# EAGLE schematic RFboardLeiden48_V_1.00 (EAGLE 7.7.0)
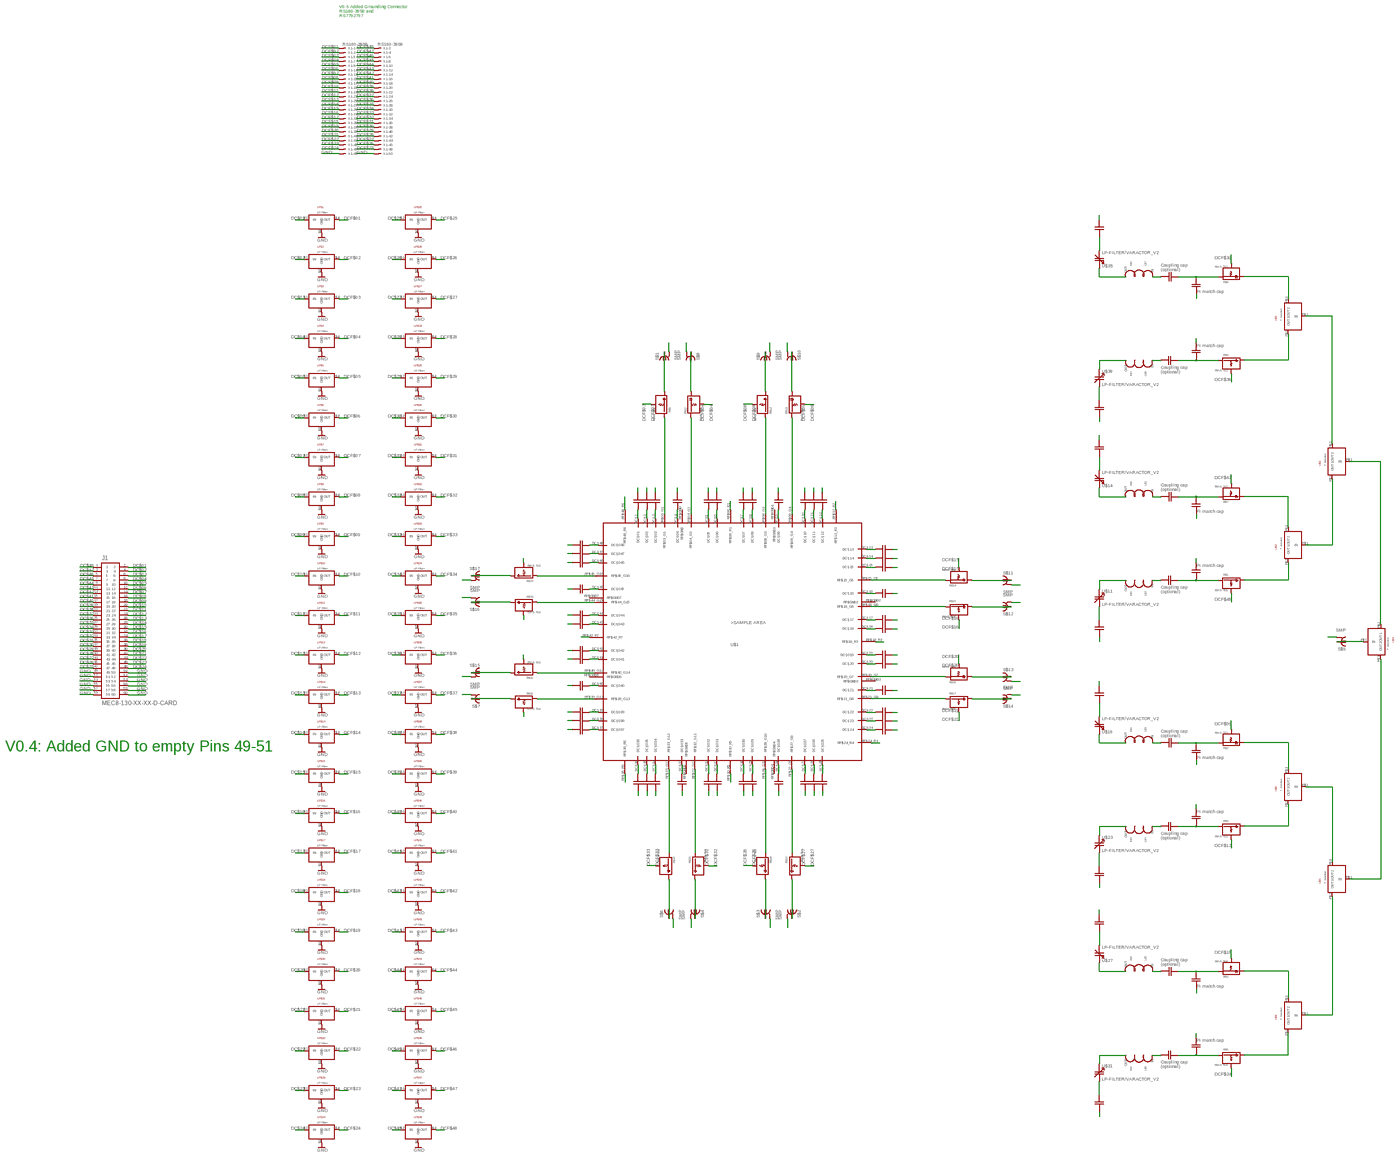
[diagram p0: schematic, sheet 1, overview]
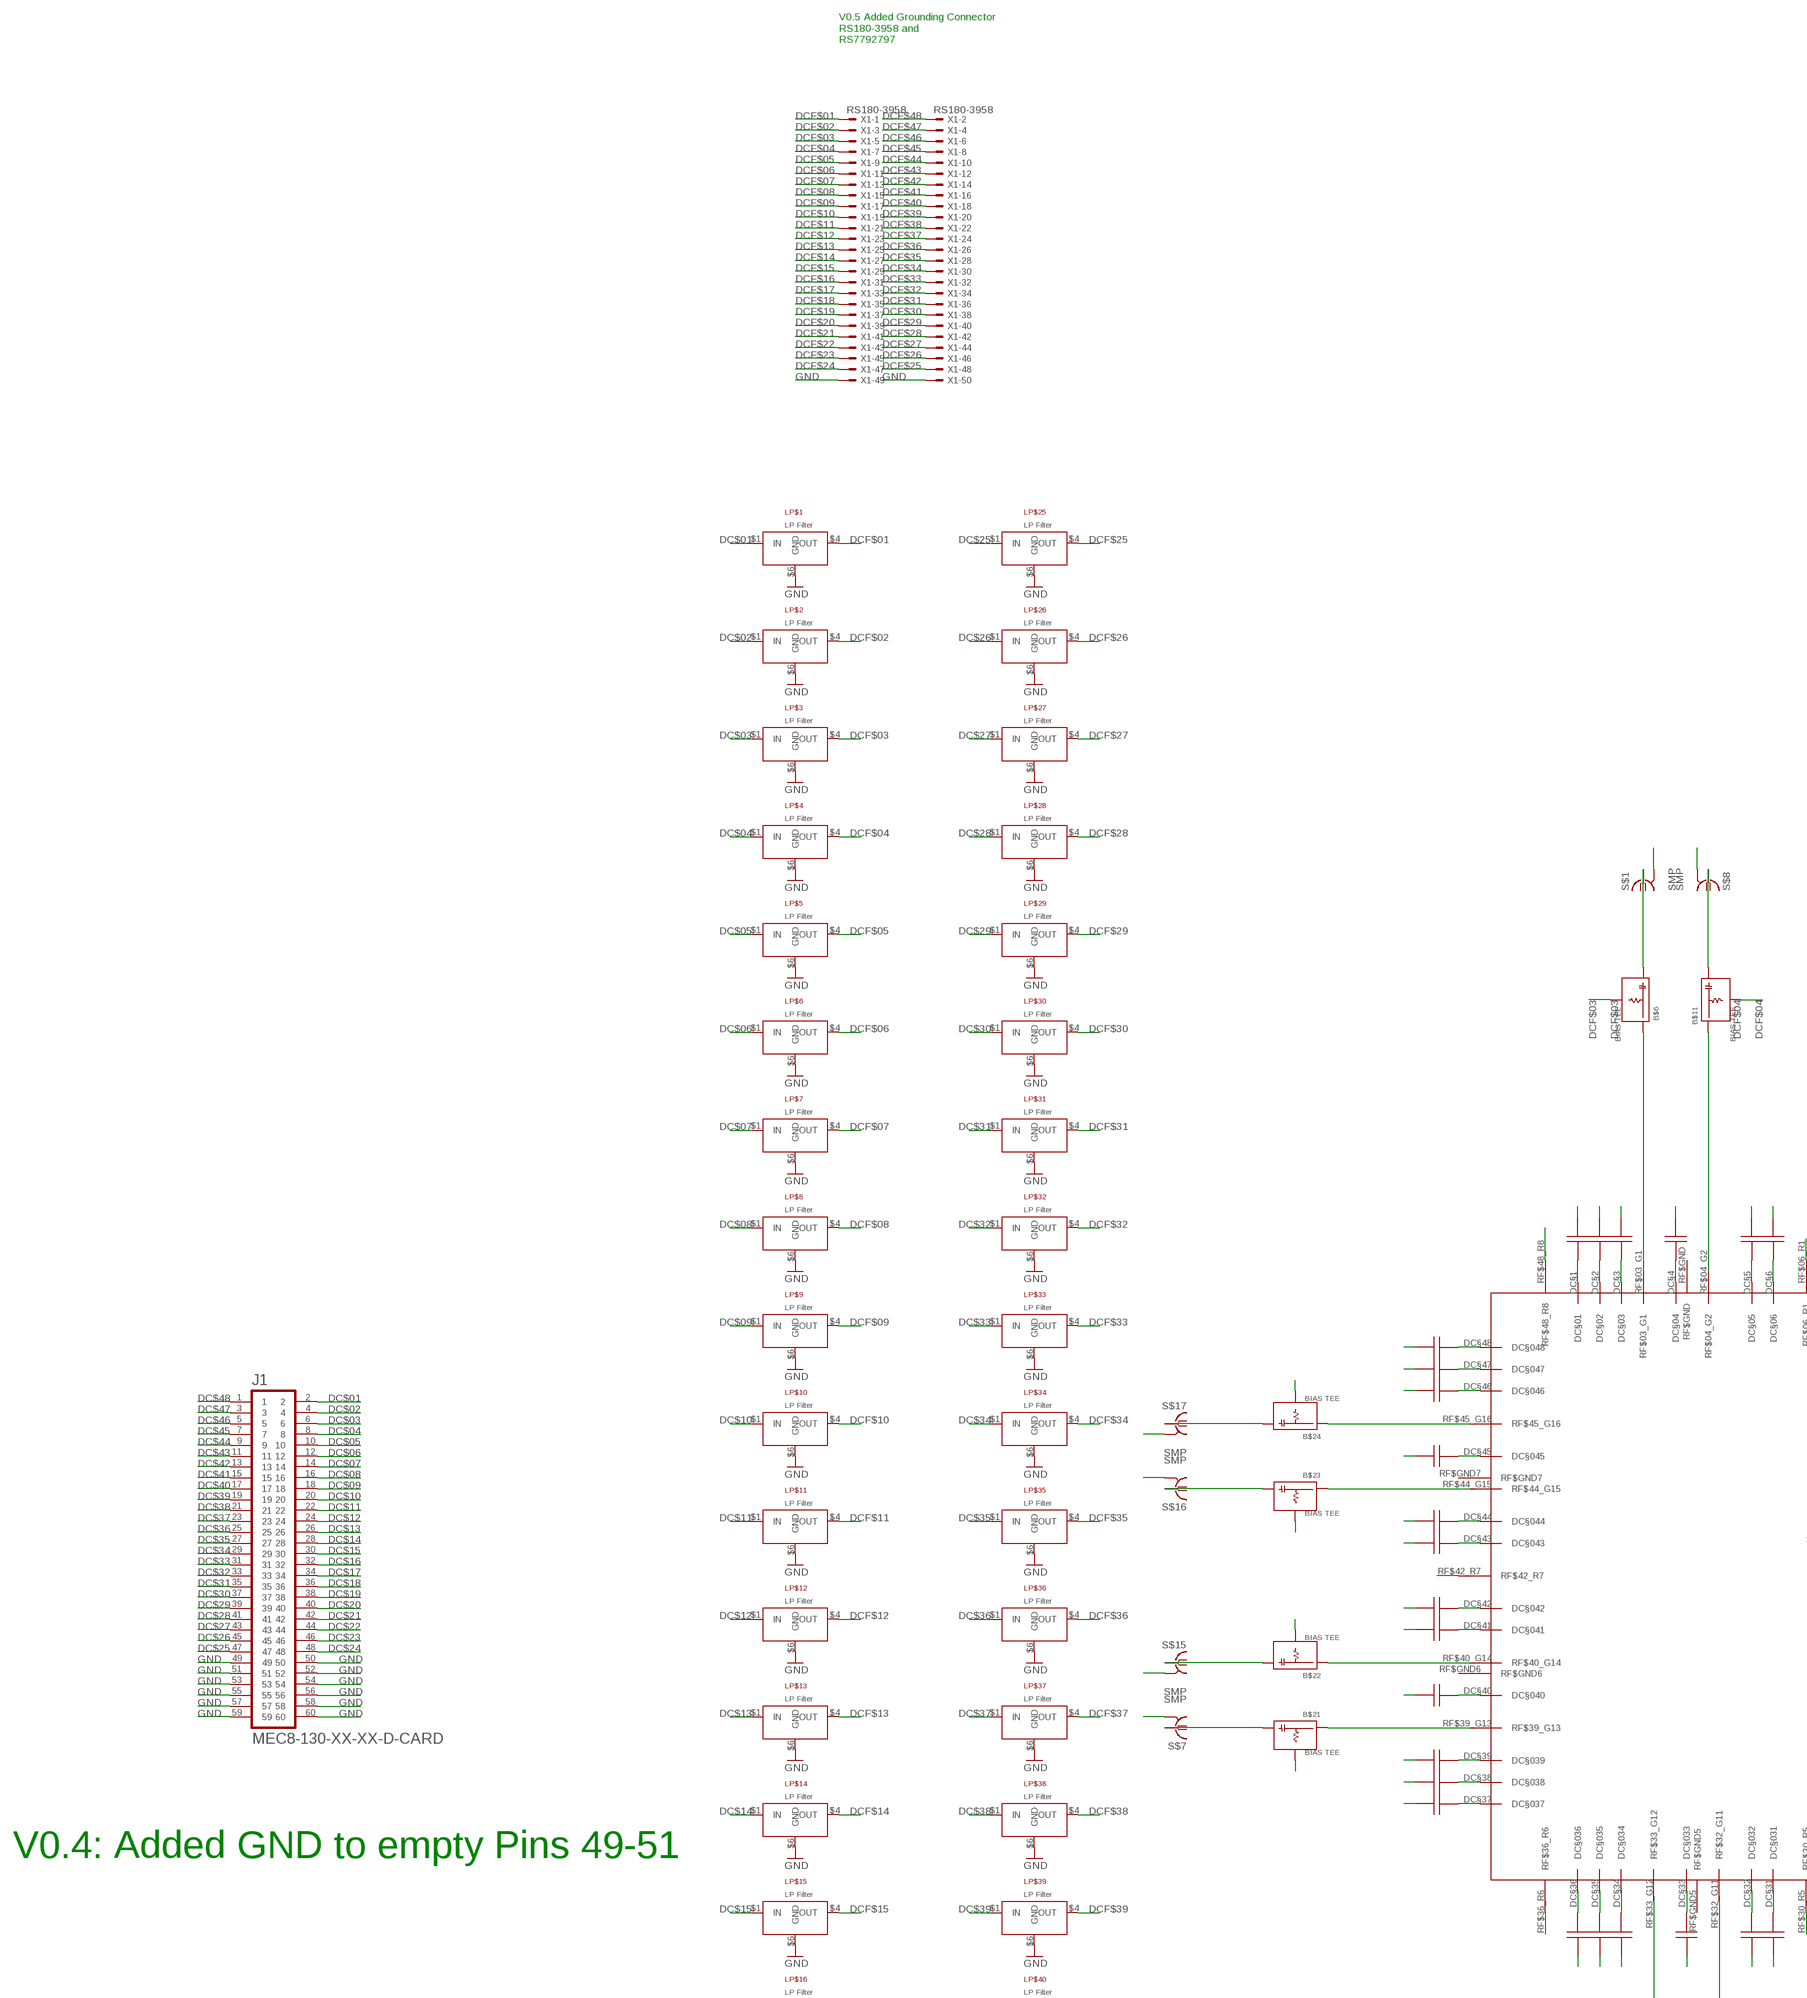
[diagram p1: schematic, sheet 1, part 1 of 4]
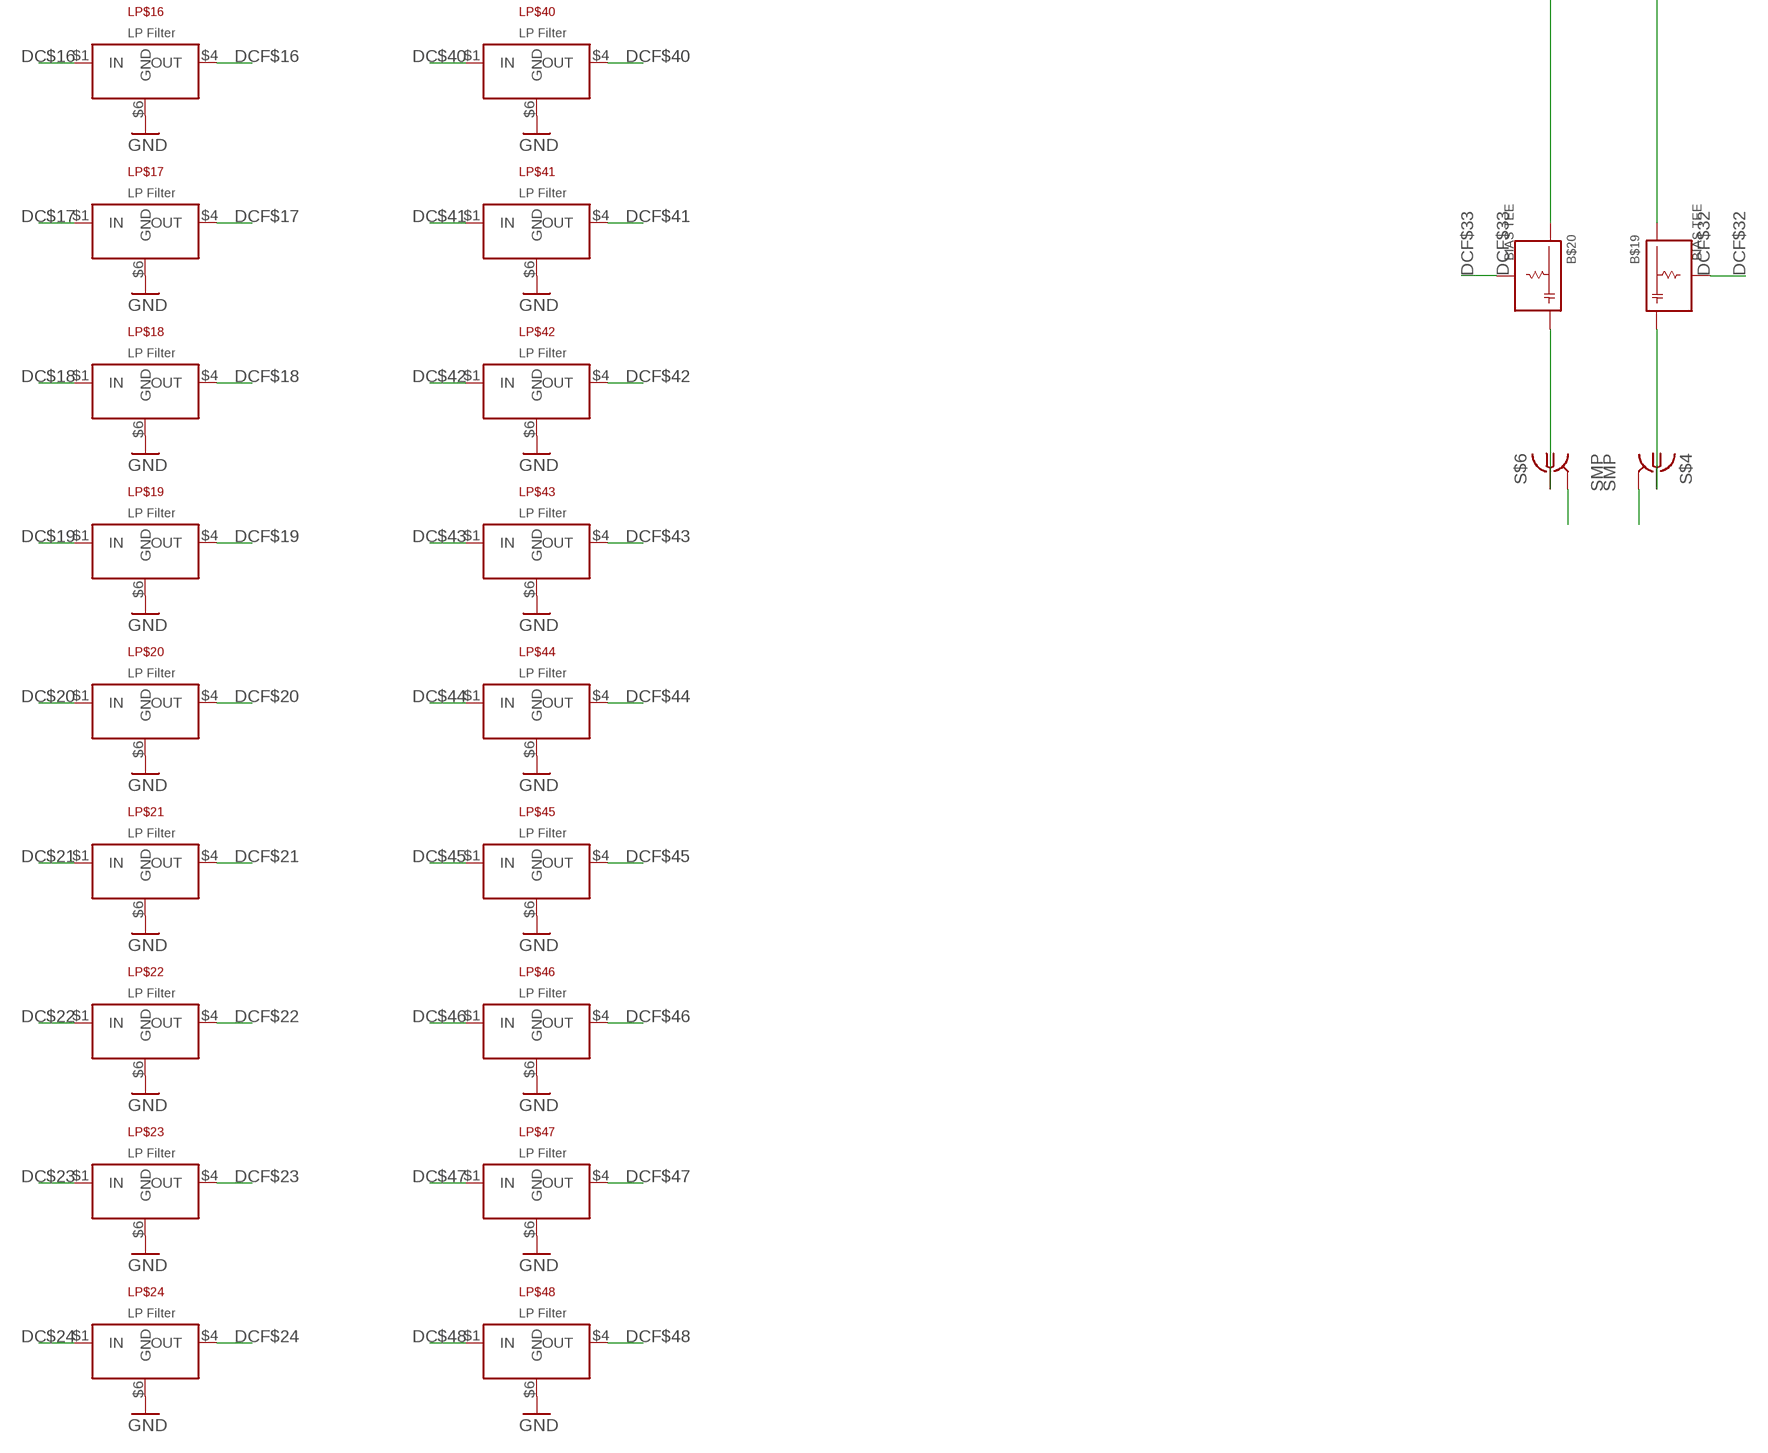
[diagram p2: schematic, sheet 1, part 2 of 4]
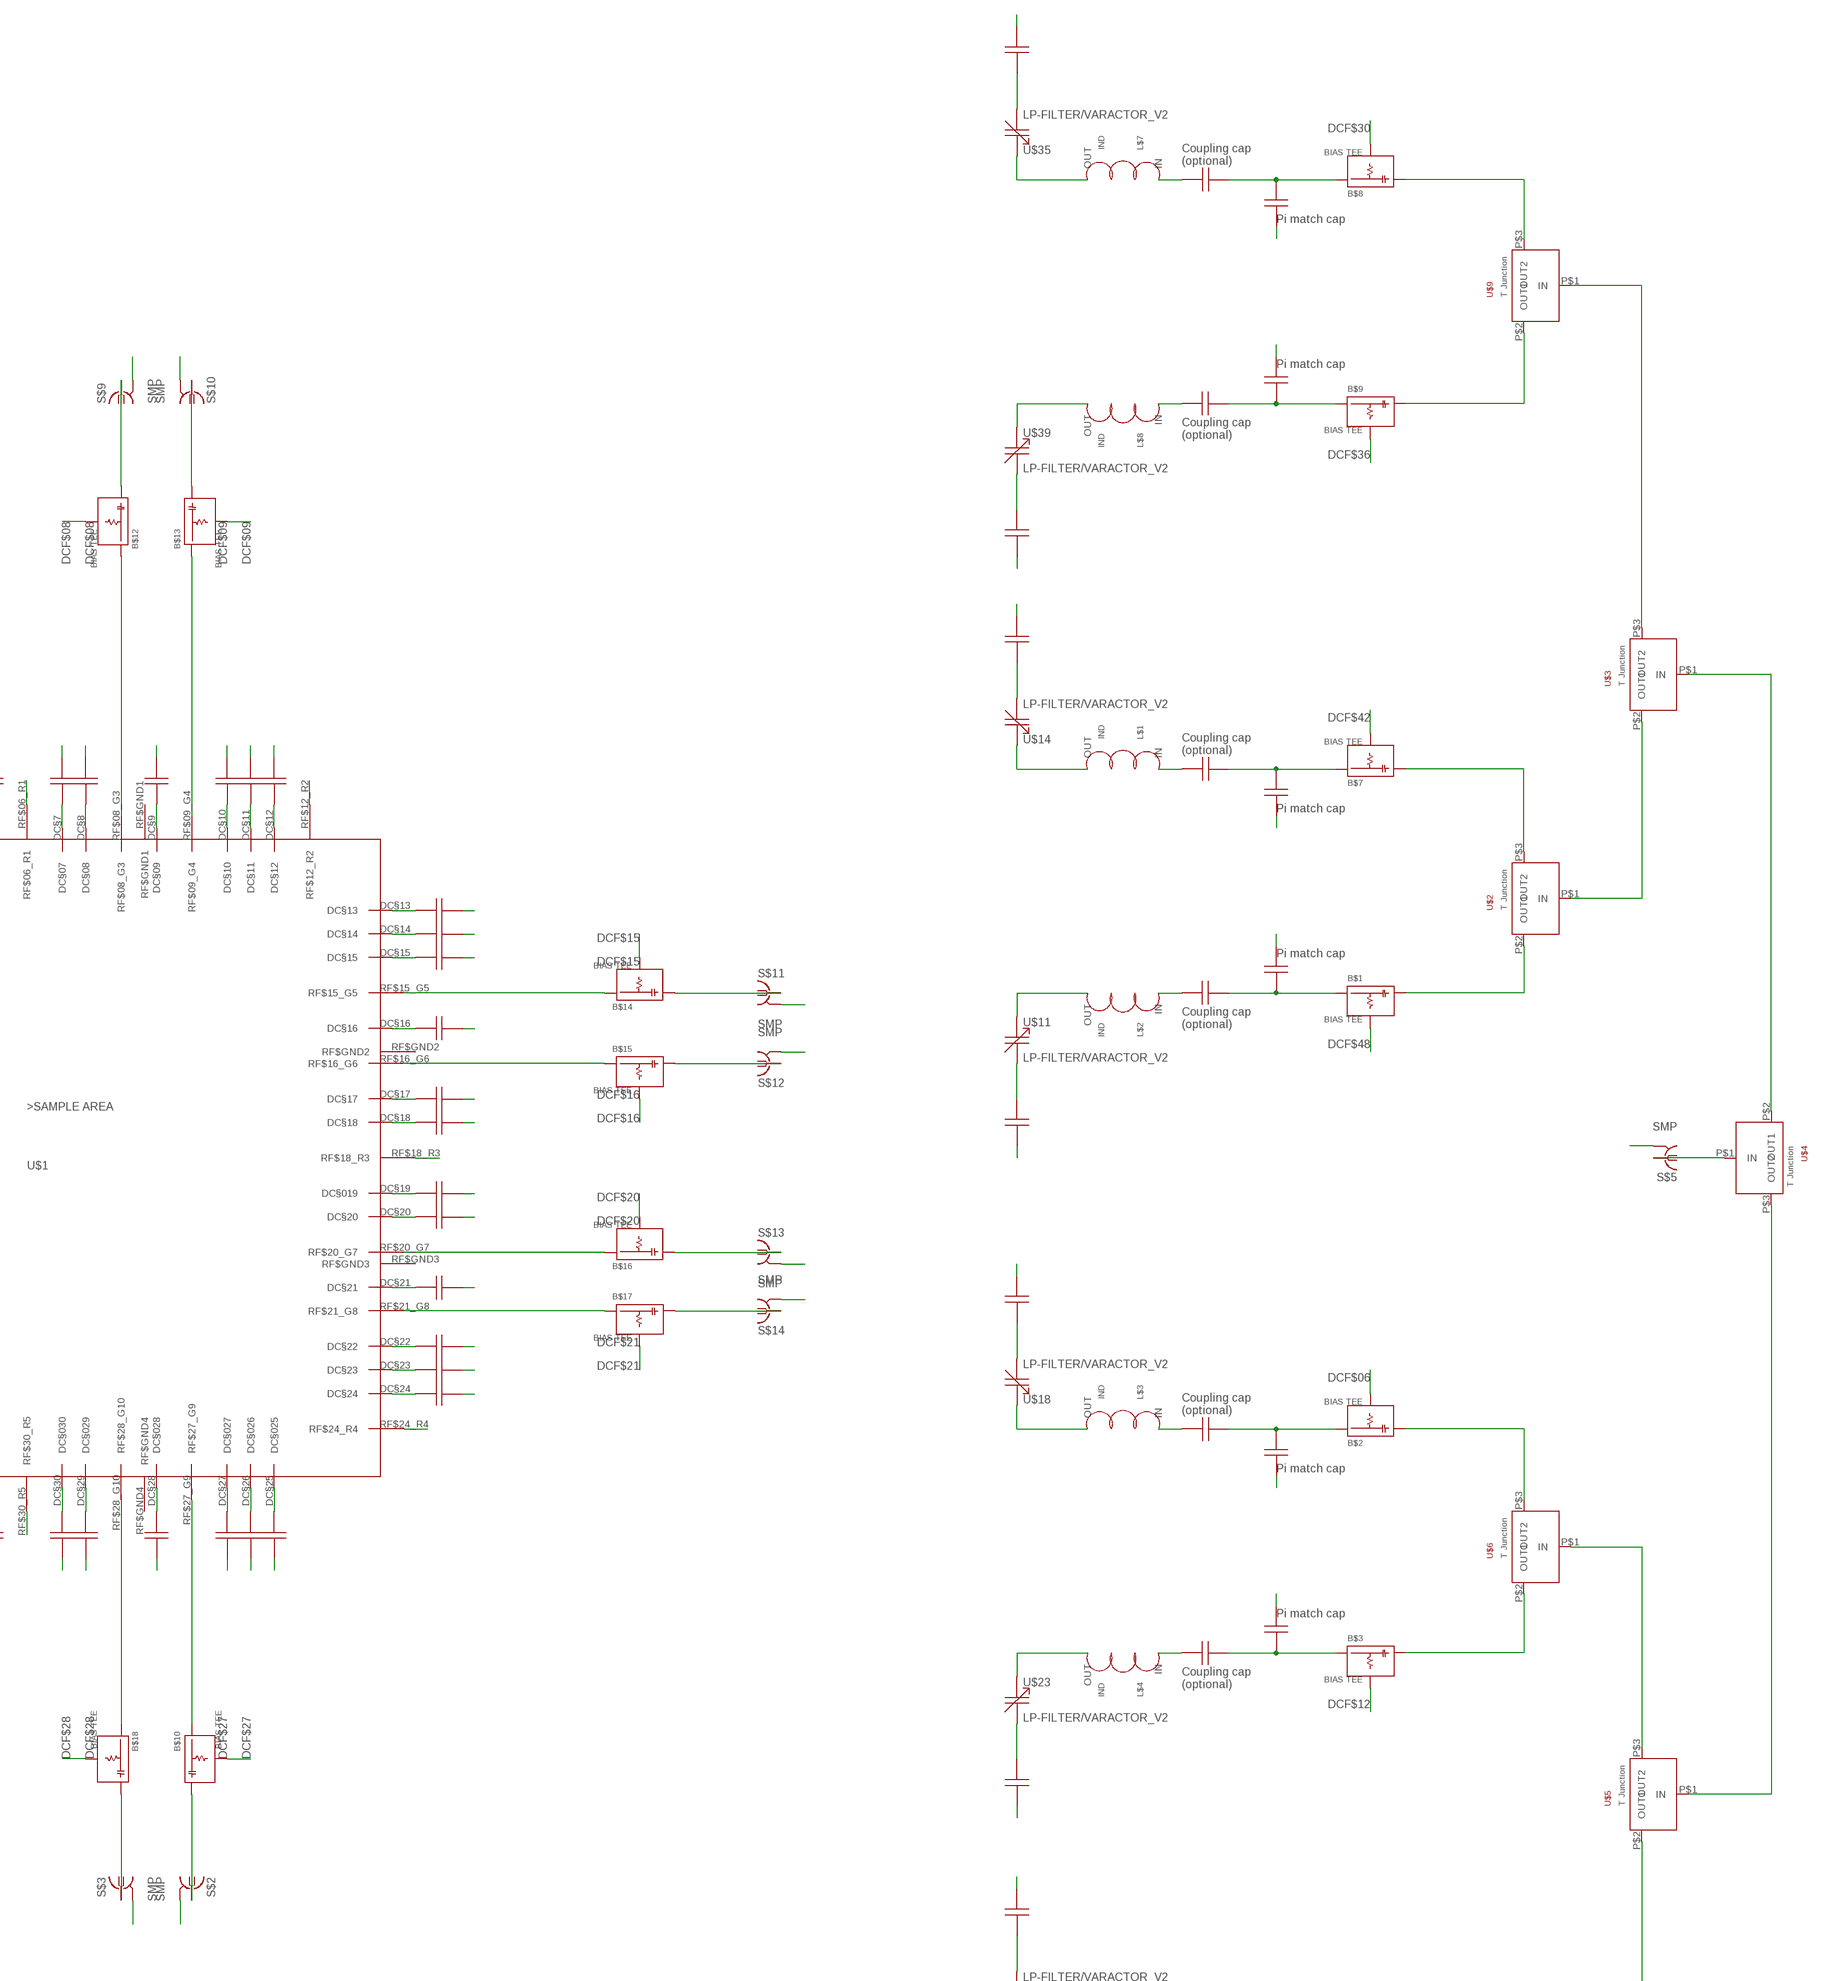
[diagram p3: schematic, sheet 1, part 3 of 4]
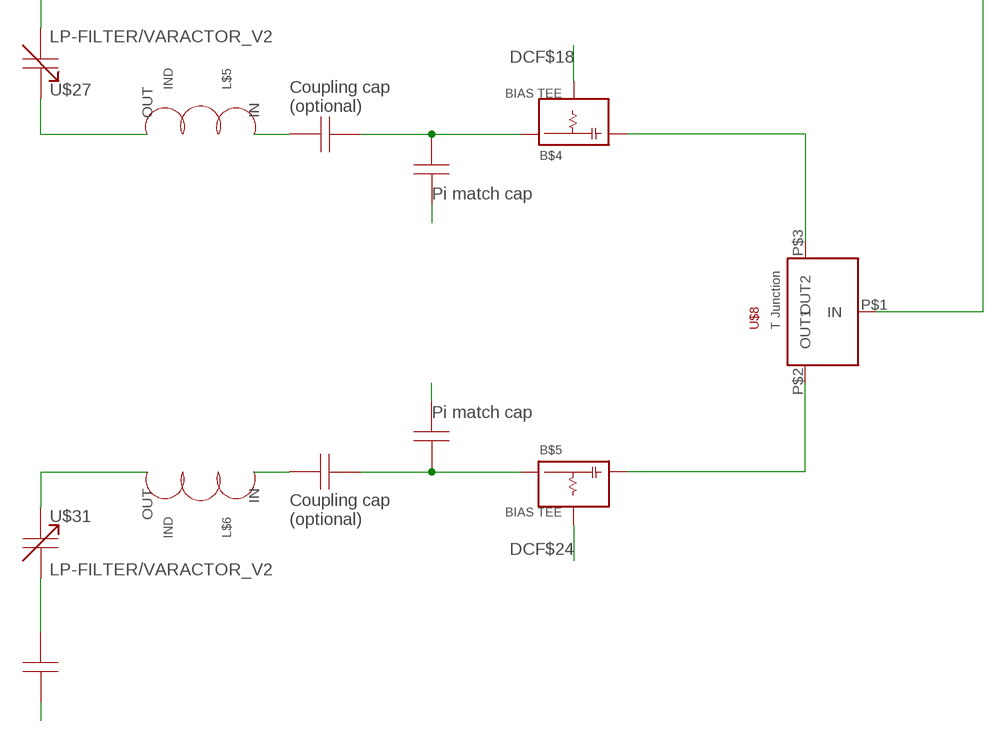
[diagram p4: schematic, sheet 1, part 4 of 4]

## Parts
B$1  BIASTEEUP1  [BIAS_TEE_UP_0603]
B$2  BIASTEEUP1  [BIAS_TEE_UP_0603]
B$3  BIASTEEUP1  [BIAS_TEE_UP_0603]
B$4  BIASTEEUP1  [BIAS_TEE_UP_0603]
B$5  BIASTEEUP1  [BIAS_TEE_UP_0603]
B$6  BIASTEEDOWN1  [BIAS_TEE_DOWN_0603]
B$7  BIASTEEUP1  [BIAS_TEE_UP_0603]
B$8  BIASTEEUP1  [BIAS_TEE_UP_0603]
B$9  BIASTEEUP1  [BIAS_TEE_UP_0603]
B$10  BIASTEEDOWN1  [BIAS_TEE_DOWN_0603]
B$11  BIASTEEDOWN1  [BIAS_TEE_DOWN_0603]
B$12  BIASTEEUP1  [BIAS_TEE_UP_0603]
B$13  BIASTEEUP1  [BIAS_TEE_UP_0603]
B$14  BIASTEEDOWN1  [BIAS_TEE_DOWN_0603]
B$15  BIASTEEDOWN1  [BIAS_TEE_DOWN_0603]
B$16  BIASTEEUP1  [BIAS_TEE_UP_0603]
B$17  BIASTEEUP1  [BIAS_TEE_UP_0603]
B$18  BIASTEEDOWN1  [BIAS_TEE_DOWN_0603]
B$19  BIASTEEUP1  [BIAS_TEE_UP_0603]
B$20  BIASTEEUP1  [BIAS_TEE_UP_0603]
B$21  BIASTEEDOWN1  [BIAS_TEE_DOWN_0603]
B$22  BIASTEEDOWN1  [BIAS_TEE_DOWN_0603]
B$23  BIASTEEUP1  [BIAS_TEE_UP_0603]
B$24  BIASTEEUP1  [BIAS_TEE_UP_0603]
J1  MEC8-130-XX-XX-D-CARD  [SAMTEC_MEC8-130-XX-XX-D-CARD]
L$1  L_MATCH  [L_MATCH]
L$2  L_MATCH  [L_MATCH]
L$3  L_MATCH  [L_MATCH]
L$4  L_MATCH  [L_MATCH]
L$5  L_MATCH  [L_MATCH]
L$6  L_MATCH  [L_MATCH]
L$7  L_MATCH  [L_MATCH]
L$8  L_MATCH  [L_MATCH]
LP$1  LP-FILTER/1-STAGETOP  [LP-FILTER/1_STAGE/OS/0603_TOP]
LP$2  LP-FILTER/1-STAGETOP  [LP-FILTER/1_STAGE/OS/0603_TOP]
LP$3  LP-FILTER/1-STAGETOP  [LP-FILTER/1_STAGE/OS/0603_TOP]
LP$4  LP-FILTER/1-STAGETOP  [LP-FILTER/1_STAGE/OS/0603_TOP]
LP$5  LP-FILTER/1-STAGETOP  [LP-FILTER/1_STAGE/OS/0603_TOP]
LP$6  LP-FILTER/1-STAGETOP  [LP-FILTER/1_STAGE/OS/0603_TOP]
LP$7  LP-FILTER/1-STAGETOP  [LP-FILTER/1_STAGE/OS/0603_TOP]
LP$8  LP-FILTER/1-STAGETOP  [LP-FILTER/1_STAGE/OS/0603_TOP]
LP$9  LP-FILTER/1-STAGETOP  [LP-FILTER/1_STAGE/OS/0603_TOP]
LP$10  LP-FILTER/1-STAGETOP  [LP-FILTER/1_STAGE/OS/0603_TOP]
LP$11  LP-FILTER/1-STAGETOP  [LP-FILTER/1_STAGE/OS/0603_TOP]
LP$12  LP-FILTER/1-STAGETOP  [LP-FILTER/1_STAGE/OS/0603_TOP]
LP$13  LP-FILTER/1-STAGETOP  [LP-FILTER/1_STAGE/OS/0603_TOP]
LP$14  LP-FILTER/1-STAGETOP  [LP-FILTER/1_STAGE/OS/0603_TOP]
LP$15  LP-FILTER/1-STAGETOP  [LP-FILTER/1_STAGE/OS/0603_TOP]
LP$16  LP-FILTER/1-STAGETOP  [LP-FILTER/1_STAGE/OS/0603_TOP]
LP$17  LP-FILTER/1-STAGETOP  [LP-FILTER/1_STAGE/OS/0603_TOP]
LP$18  LP-FILTER/1-STAGETOP  [LP-FILTER/1_STAGE/OS/0603_TOP]
LP$19  LP-FILTER/1-STAGETOP  [LP-FILTER/1_STAGE/OS/0603_TOP]
LP$20  LP-FILTER/1-STAGETOP  [LP-FILTER/1_STAGE/OS/0603_TOP]
LP$21  LP-FILTER/1-STAGETOP  [LP-FILTER/1_STAGE/OS/0603_TOP]
LP$22  LP-FILTER/1-STAGETOP  [LP-FILTER/1_STAGE/OS/0603_TOP]
LP$23  LP-FILTER/1-STAGETOP  [LP-FILTER/1_STAGE/OS/0603_TOP]
LP$24  LP-FILTER/1-STAGETOP  [LP-FILTER/1_STAGE/OS/0603_TOP]
LP$25  LP-FILTER/1-STAGETOP  [LP-FILTER/1_STAGE/OS/0603_TOP]
LP$26  LP-FILTER/1-STAGETOP  [LP-FILTER/1_STAGE/OS/0603_TOP]
LP$27  LP-FILTER/1-STAGETOP  [LP-FILTER/1_STAGE/OS/0603_TOP]
LP$28  LP-FILTER/1-STAGETOP  [LP-FILTER/1_STAGE/OS/0603_TOP]
LP$29  LP-FILTER/1-STAGETOP  [LP-FILTER/1_STAGE/OS/0603_TOP]
LP$30  LP-FILTER/1-STAGETOP  [LP-FILTER/1_STAGE/OS/0603_TOP]
LP$31  LP-FILTER/1-STAGETOP  [LP-FILTER/1_STAGE/OS/0603_TOP]
LP$32  LP-FILTER/1-STAGETOP  [LP-FILTER/1_STAGE/OS/0603_TOP]
LP$33  LP-FILTER/1-STAGETOP  [LP-FILTER/1_STAGE/OS/0603_TOP]
LP$34  LP-FILTER/1-STAGETOP  [LP-FILTER/1_STAGE/OS/0603_TOP]
LP$35  LP-FILTER/1-STAGETOP  [LP-FILTER/1_STAGE/OS/0603_TOP]
LP$36  LP-FILTER/1-STAGETOP  [LP-FILTER/1_STAGE/OS/0603_TOP]
LP$37  LP-FILTER/1-STAGETOP  [LP-FILTER/1_STAGE/OS/0603_TOP]
LP$38  LP-FILTER/1-STAGETOP  [LP-FILTER/1_STAGE/OS/0603_TOP]
LP$39  LP-FILTER/1-STAGETOP  [LP-FILTER/1_STAGE/OS/0603_TOP]
LP$40  LP-FILTER/1-STAGETOP  [LP-FILTER/1_STAGE/OS/0603_TOP]
LP$41  LP-FILTER/1-STAGETOP  [LP-FILTER/1_STAGE/OS/0603_TOP]
LP$42  LP-FILTER/1-STAGETOP  [LP-FILTER/1_STAGE/OS/0603_TOP]
LP$43  LP-FILTER/1-STAGETOP  [LP-FILTER/1_STAGE/OS/0603_TOP]
LP$44  LP-FILTER/1-STAGETOP  [LP-FILTER/1_STAGE/OS/0603_TOP]
LP$45  LP-FILTER/1-STAGETOP  [LP-FILTER/1_STAGE/OS/0603_TOP]
LP$46  LP-FILTER/1-STAGETOP  [LP-FILTER/1_STAGE/OS/0603_TOP]
LP$47  LP-FILTER/1-STAGETOP  [LP-FILTER/1_STAGE/OS/0603_TOP]
LP$48  LP-FILTER/1-STAGETOP  [LP-FILTER/1_STAGE/OS/0603_TOP]
S$1  MC-921WIDE  [SMP_STRAIGHT_MINI_WIDE]
S$2  MC-921WIDE  [SMP_STRAIGHT_MINI_WIDE]
S$3  MC-921WIDE  [SMP_STRAIGHT_MINI_WIDE]
S$4  MC-921WIDE  [SMP_STRAIGHT_MINI_WIDE]
S$5  MC-921WIDE  [SMP_STRAIGHT_MINI_WIDE]
S$6  MC-921WIDE  [SMP_STRAIGHT_MINI_WIDE]
S$7  MC-921WIDE  [SMP_STRAIGHT_MINI_WIDE]
S$8  MC-921WIDE  [SMP_STRAIGHT_MINI_WIDE]
S$9  MC-921WIDE  [SMP_STRAIGHT_MINI_WIDE]
S$10  MC-921WIDE  [SMP_STRAIGHT_MINI_WIDE]
S$11  MC-921WIDE  [SMP_STRAIGHT_MINI_WIDE]
S$12  MC-921WIDE  [SMP_STRAIGHT_MINI_WIDE]
S$13  MC-921WIDE  [SMP_STRAIGHT_MINI_WIDE]
S$14  MC-921WIDE  [SMP_STRAIGHT_MINI_WIDE]
S$15  MC-921WIDE  [SMP_STRAIGHT_MINI_WIDE]
S$16  MC-921WIDE  [SMP_STRAIGHT_MINI_WIDE]
S$17  MC-921WIDE  [SMP_STRAIGHT_MINI_WIDE]
U$1  48DC+24RF_V3.0  [48DC+24RF_V3.0]
U$2  TJUNCTION  [T_JUNCTION_0.3MM]
U$3  TJUNCTION  [T_JUNCTION_0.3MM]
U$4  TJUNCTION  [T_JUNCTION_0.3MM]
U$5  TJUNCTION  [T_JUNCTION_0.3MM]
U$6  TJUNCTION  [T_JUNCTION_0.3MM]
U$7  LP-FILTER/CAPACITOR/0603THIN  [LP-FILTER/CAPACITOR/0603_BOTTOM]
U$8  TJUNCTION  [T_JUNCTION_0.3MM]
U$9  TJUNCTION  [T_JUNCTION_0.3MM]
U$10  LP-FILTER/CAPACITOR/0603THIN  [LP-FILTER/CAPACITOR/0603_BOTTOM]
U$11  LP-FILTER/VARACTOR_V2  [LP-FILTER/VARACTOR_V2]
U$12  LP-FILTER/CAPACITOR/0603NORMAL  [LP-FILTER/CAPACITOR/0603_BOTTOM_V2]
U$13  LP-FILTER/CAPACITOR/0603THIN  [LP-FILTER/CAPACITOR/0603_BOTTOM]
U$14  LP-FILTER/VARACTOR_V2  [LP-FILTER/VARACTOR_V2]
U$15  LP-FILTER/CAPACITOR/0603NORMAL  [LP-FILTER/CAPACITOR/0603_BOTTOM_V2]
U$16  LP-FILTER/CAPACITOR/0603THIN  [LP-FILTER/CAPACITOR/0603_BOTTOM]
U$17  LP-FILTER/CAPACITOR/0603THIN  [LP-FILTER/CAPACITOR/0603_BOTTOM]
U$18  LP-FILTER/VARACTOR_V2  [LP-FILTER/VARACTOR_V2]
U$19  LP-FILTER/CAPACITOR/0603NORMAL  [LP-FILTER/CAPACITOR/0603_BOTTOM_V2]
U$20  LP-FILTER/CAPACITOR/0603THIN  [LP-FILTER/CAPACITOR/0603_BOTTOM]
U$21  LP-FILTER/CAPACITOR/0603THIN  [LP-FILTER/CAPACITOR/0603_BOTTOM]
U$22  LP-FILTER/CAPACITOR/0603THIN  [LP-FILTER/CAPACITOR/0603_BOTTOM]
U$23  LP-FILTER/VARACTOR_V2  [LP-FILTER/VARACTOR_V2]
U$24  LP-FILTER/CAPACITOR/0603NORMAL  [LP-FILTER/CAPACITOR/0603_BOTTOM_V2]
U$26  LP-FILTER/CAPACITOR/0603THIN  [LP-FILTER/CAPACITOR/0603_BOTTOM]
U$27  LP-FILTER/VARACTOR_V2  [LP-FILTER/VARACTOR_V2]
U$28  LP-FILTER/CAPACITOR/0603NORMAL  [LP-FILTER/CAPACITOR/0603_BOTTOM_V2]
U$29  LP-FILTER/CAPACITOR/0603THIN  [LP-FILTER/CAPACITOR/0603_BOTTOM]
U$30  LP-FILTER/CAPACITOR/0603THIN  [LP-FILTER/CAPACITOR/0603_BOTTOM]
U$31  LP-FILTER/VARACTOR_V2  [LP-FILTER/VARACTOR_V2]
U$32  LP-FILTER/CAPACITOR/0603NORMAL  [LP-FILTER/CAPACITOR/0603_BOTTOM_V2]
U$33  LP-FILTER/CAPACITOR/0603THIN  [LP-FILTER/CAPACITOR/0603_BOTTOM]
U$34  LP-FILTER/CAPACITOR/0603THIN  [LP-FILTER/CAPACITOR/0603_BOTTOM]
U$35  LP-FILTER/VARACTOR_V2  [LP-FILTER/VARACTOR_V2]
U$36  LP-FILTER/CAPACITOR/0603NORMAL  [LP-FILTER/CAPACITOR/0603_BOTTOM_V2]
U$37  LP-FILTER/CAPACITOR/0603THIN  [LP-FILTER/CAPACITOR/0603_BOTTOM]
U$38  LP-FILTER/CAPACITOR/0603THIN  [LP-FILTER/CAPACITOR/0603_BOTTOM]
U$39  LP-FILTER/VARACTOR_V2  [LP-FILTER/VARACTOR_V2]
U$40  LP-FILTER/CAPACITOR/0603NORMAL  [LP-FILTER/CAPACITOR/0603_BOTTOM_V2]
U$41  LP-FILTER/CAPACITOR/0603THIN  [LP-FILTER/CAPACITOR/0603_BOTTOM]
U$42  LP-FILTER/CAPACITOR/0603THIN  [LP-FILTER/CAPACITOR/0603_BOTTOM]
U$43  LP-FILTER/CAPACITOR/0603THIN  [LP-FILTER/CAPACITOR/0603_BOTTOM]
U$44  LP-FILTER/CAPACITOR/0603THIN  [LP-FILTER/CAPACITOR/0603_BOTTOM]
U$45  LP-FILTER/CAPACITOR/0603THIN  [LP-FILTER/CAPACITOR/0603_BOTTOM]
U$46  LP-FILTER/CAPACITOR/0603THIN  [LP-FILTER/CAPACITOR/0603_BOTTOM]
U$47  LP-FILTER/CAPACITOR/0603THIN  [LP-FILTER/CAPACITOR/0603_BOTTOM]
U$48  LP-FILTER/CAPACITOR/0603THIN  [LP-FILTER/CAPACITOR/0603_BOTTOM]
U$49  LP-FILTER/CAPACITOR/0603THIN  [LP-FILTER/CAPACITOR/0603_BOTTOM]
U$50  LP-FILTER/CAPACITOR/0603THIN  [LP-FILTER/CAPACITOR/0603_BOTTOM]
U$51  LP-FILTER/CAPACITOR/0603THIN  [LP-FILTER/CAPACITOR/0603_BOTTOM]
U$52  LP-FILTER/CAPACITOR/0603THIN  [LP-FILTER/CAPACITOR/0603_BOTTOM]
U$53  LP-FILTER/CAPACITOR/0603THIN  [LP-FILTER/CAPACITOR/0603_BOTTOM]
U$54  LP-FILTER/CAPACITOR/0603THIN  [LP-FILTER/CAPACITOR/0603_BOTTOM]
U$55  LP-FILTER/CAPACITOR/0603THIN  [LP-FILTER/CAPACITOR/0603_BOTTOM]
U$56  LP-FILTER/CAPACITOR/0603THIN  [LP-FILTER/CAPACITOR/0603_BOTTOM]
U$57  LP-FILTER/CAPACITOR/0603THIN  [LP-FILTER/CAPACITOR/0603_BOTTOM]
U$58  LP-FILTER/CAPACITOR/0603THIN  [LP-FILTER/CAPACITOR/0603_BOTTOM]
U$59  LP-FILTER/CAPACITOR/0603THIN  [LP-FILTER/CAPACITOR/0603_BOTTOM]
U$60  LP-FILTER/CAPACITOR/0603THIN  [LP-FILTER/CAPACITOR/0603_BOTTOM]
U$61  LP-FILTER/CAPACITOR/0603THIN  [LP-FILTER/CAPACITOR/0603_BOTTOM]
U$62  LP-FILTER/CAPACITOR/0603THIN  [LP-FILTER/CAPACITOR/0603_BOTTOM]
U$63  LP-FILTER/CAPACITOR/0603THIN  [LP-FILTER/CAPACITOR/0603_BOTTOM]
U$64  LP-FILTER/CAPACITOR/0603THIN  [LP-FILTER/CAPACITOR/0603_BOTTOM]
U$65  LP-FILTER/CAPACITOR/0603THIN  [LP-FILTER/CAPACITOR/0603_BOTTOM]
U$66  LP-FILTER/CAPACITOR/0603THIN  [LP-FILTER/CAPACITOR/0603_BOTTOM]
U$67  LP-FILTER/CAPACITOR/0603THIN  [LP-FILTER/CAPACITOR/0603_BOTTOM]
U$68  LP-FILTER/CAPACITOR/0603THIN  [LP-FILTER/CAPACITOR/0603_BOTTOM]
U$69  LP-FILTER/CAPACITOR/0603THIN  [LP-FILTER/CAPACITOR/0603_BOTTOM]
U$70  LP-FILTER/CAPACITOR/0603THIN  [LP-FILTER/CAPACITOR/0603_BOTTOM]
U$71  LP-FILTER/CAPACITOR/0603THIN  [LP-FILTER/CAPACITOR/0603_BOTTOM]
U$72  LP-FILTER/CAPACITOR/0603THIN  [LP-FILTER/CAPACITOR/0603_BOTTOM]
U$73  LP-FILTER/CAPACITOR/0603THIN  [LP-FILTER/CAPACITOR/0603_BOTTOM]
U$74  LP-FILTER/CAPACITOR/0603THIN  [LP-FILTER/CAPACITOR/0603_BOTTOM]
U$75  LP-FILTER/CAPACITOR/0603THIN  [LP-FILTER/CAPACITOR/0603_BOTTOM]
U$76  LP-FILTER/CAPACITOR/0603THIN  [LP-FILTER/CAPACITOR/0603_BOTTOM]
U$77  LP-FILTER/CAPACITOR/0603THIN  [LP-FILTER/CAPACITOR/0603_BOTTOM]
U$78  LP-FILTER/CAPACITOR/0603THIN  [LP-FILTER/CAPACITOR/0603_BOTTOM]
U$79  LP-FILTER/CAPACITOR/0603THIN  [LP-FILTER/CAPACITOR/0603_BOTTOM]
U$80  LP-FILTER/CAPACITOR/0603THIN  [LP-FILTER/CAPACITOR/0603_BOTTOM]
U$81  LP-FILTER/CAPACITOR/0603THIN  [LP-FILTER/CAPACITOR/0603_BOTTOM]
U$82  LP-FILTER/CAPACITOR/0603THIN  [LP-FILTER/CAPACITOR/0603_BOTTOM]
U$83  LP-FILTER/CAPACITOR/0603THIN  [LP-FILTER/CAPACITOR/0603_BOTTOM]
U$84  LP-FILTER/CAPACITOR/0603THIN  [LP-FILTER/CAPACITOR/0603_BOTTOM]
U$85  LP-FILTER/CAPACITOR/0603THIN  [LP-FILTER/CAPACITOR/0603_BOTTOM]
U$86  LP-FILTER/CAPACITOR/0603THIN  [LP-FILTER/CAPACITOR/0603_BOTTOM]
U$87  LP-FILTER/CAPACITOR/0603THIN  [LP-FILTER/CAPACITOR/0603_BOTTOM]
U$88  LP-FILTER/CAPACITOR/0603THIN  [LP-FILTER/CAPACITOR/0603_BOTTOM]
U$89  LP-FILTER/CAPACITOR/0603THIN  [LP-FILTER/CAPACITOR/0603_BOTTOM]
X1  RS180-3958  87758-5016  [SMDSMALL87758-5016]

## Nets
DC$01: J1.2 LP$1.$1(IN)
DC$02: J1.4 LP$2.$1(IN)
DC$03: J1.6 LP$3.$1(IN)
DC$04: J1.8 LP$4.$1(IN)
DC$05: J1.10 LP$5.$1(IN)
DC$06: J1.12 LP$6.$1(IN)
DC$07: J1.14 LP$7.$1(IN)
DC$08: J1.16 LP$8.$1(IN)
DC$09: J1.18 LP$9.$1(IN)
DC$10: J1.20 LP$10.$1(IN)
DC$11: J1.22 LP$11.$1(IN)
DC$12: J1.24 LP$12.$1(IN)
DC$13: J1.26 LP$13.$1(IN)
DC$14: J1.28 LP$14.$1(IN)
DC$15: J1.30 LP$15.$1(IN)
DC$16: J1.32 LP$16.$1(IN)
DC$17: J1.34 LP$17.$1(IN)
DC$18: J1.36 LP$18.$1(IN)
DC$19: J1.38 LP$19.$1(IN)
DC$20: J1.40 LP$20.$1(IN)
DC$21: J1.42 LP$21.$1(IN)
DC$22: J1.44 LP$22.$1(IN)
DC$23: J1.46 LP$23.$1(IN)
DC$24: J1.48 LP$24.$1(IN)
DC$25: J1.47 LP$25.$1(IN)
DC$26: J1.45 LP$26.$1(IN)
DC$27: J1.43 LP$27.$1(IN)
DC$28: J1.41 LP$28.$1(IN)
DC$29: J1.39 LP$29.$1(IN)
DC$30: J1.37 LP$30.$1(IN)
DC$31: J1.35 LP$31.$1(IN)
DC$32: J1.33 LP$32.$1(IN)
DC$33: J1.31 LP$33.$1(IN)
DC$34: J1.29 LP$34.$1(IN)
DC$35: J1.27 LP$35.$1(IN)
DC$36: J1.25 LP$36.$1(IN)
DC$37: J1.23 LP$37.$1(IN)
DC$38: J1.21 LP$38.$1(IN)
DC$39: J1.19 LP$39.$1(IN)
DC$40: J1.17 LP$40.$1(IN)
DC$41: J1.15 LP$41.$1(IN)
DC$42: J1.13 LP$42.$1(IN)
DC$43: J1.11 LP$43.$1(IN)
DC$44: J1.9 LP$44.$1(IN)
DC$45: J1.7 LP$45.$1(IN)
DC$46: J1.5 LP$46.$1(IN)
DC$47: J1.3 LP$47.$1(IN)
DC$48: J1.1 LP$48.$1(IN)
DCF$01: LP$1.$4(OUT) U$1.DC§1(DC§01) U$11.OUT1 U$12.OUT U$42.OUT X1.P$1
DCF$02: LP$2.$4(OUT) U$1.DC§2(DC§02) U$43.OUT X1.P$3
DCF$03: B$6.LF LP$3.$4(OUT) U$1.DC§3(DC§03) U$44.OUT X1.P$5
DCF$04: B$11.LF LP$4.$4(OUT) U$1.DC§4(DC§04) U$45.OUT X1.P$7
DCF$05: LP$5.$4(OUT) U$1.DC§5(DC§05) U$46.OUT X1.P$9
DCF$06: B$2.LF LP$6.$4(OUT) U$1.DC§6(DC§06) U$47.OUT X1.P$11
DCF$07: LP$7.$4(OUT) U$1.DC§7(DC§07) U$18.OUT1 U$19.OUT U$48.OUT X1.P$13
DCF$08: B$12.LF LP$8.$4(OUT) U$1.DC§8(DC§08) U$49.OUT X1.P$15
DCF$09: B$13.LF LP$9.$4(OUT) U$1.DC§9(DC§09) U$50.OUT X1.P$17
DCF$10: LP$10.$4(OUT) U$1.DC§10 U$51.OUT X1.P$19
DCF$11: LP$11.$4(OUT) U$1.DC§11 U$52.OUT X1.P$21
DCF$12: B$3.LF LP$12.$4(OUT) U$1.DC§12 U$53.OUT X1.P$23
DCF$13: LP$13.$4(OUT) U$1.DC§13 U$23.OUT1 U$24.OUT U$54.IN X1.P$25
DCF$14: LP$14.$4(OUT) U$1.DC§14 U$55.IN X1.P$27
DCF$15: B$14.LF LP$15.$4(OUT) U$1.DC§15 U$56.IN X1.P$29
DCF$16: B$15.LF LP$16.$4(OUT) U$1.DC§16 U$57.IN X1.P$31
DCF$17: LP$17.$4(OUT) U$1.DC§17 U$58.IN X1.P$33
DCF$18: B$4.LF LP$18.$4(OUT) U$1.DC§18 U$59.IN X1.P$35
DCF$19: LP$19.$4(OUT) U$1.DC§19(DC§019) U$27.OUT1 U$28.OUT U$60.IN X1.P$37
DCF$20: B$16.LF LP$20.$4(OUT) U$1.DC§20 U$61.IN X1.P$39
DCF$21: B$17.LF LP$21.$4(OUT) U$1.DC§21 U$62.IN X1.P$41
DCF$22: LP$22.$4(OUT) U$1.DC§22 U$63.IN X1.P$43
DCF$23: LP$23.$4(OUT) U$1.DC§23 U$64.IN X1.P$45
DCF$24: B$5.LF LP$24.$4(OUT) U$1.DC§24 U$65.IN X1.P$47
DCF$25: LP$25.$4(OUT) U$1.DC§25(DC§025) U$31.OUT1 U$32.OUT U$66.IN X1.P$48
DCF$26: LP$26.$4(OUT) U$1.DC§26(DC§026) U$67.IN X1.P$46
DCF$27: B$10.LF LP$27.$4(OUT) U$1.DC§27(DC§027) U$68.IN X1.P$44
DCF$28: B$18.LF LP$28.$4(OUT) U$1.DC§28(DC§028) U$69.IN X1.P$42
DCF$29: LP$29.$4(OUT) U$1.DC§29(DC§029) U$70.IN X1.P$40
DCF$30: B$8.LF LP$30.$4(OUT) U$1.DC§30(DC§030) U$71.IN X1.P$38
DCF$31: LP$31.$4(OUT) U$1.DC§31(DC§031) U$35.OUT1 U$36.OUT U$72.IN X1.P$36
DCF$32: B$19.LF LP$32.$4(OUT) U$1.DC§32(DC§032) U$73.IN X1.P$34
DCF$33: B$20.LF LP$33.$4(OUT) U$1.DC§33(DC§033) U$74.IN X1.P$32
DCF$34: LP$34.$4(OUT) U$1.DC§34(DC§034) U$75.IN X1.P$30
DCF$35: LP$35.$4(OUT) U$1.DC§35(DC§035) U$76.IN X1.P$28
DCF$36: B$9.LF LP$36.$4(OUT) U$1.DC§36(DC§036) U$77.IN X1.P$26
DCF$37: LP$37.$4(OUT) U$1.DC§37(DC§037) U$39.OUT1 U$40.OUT U$78.IN X1.P$24
DCF$38: LP$38.$4(OUT) U$1.DC§38(DC§038) U$79.IN X1.P$22
DCF$39: B$21.LF LP$39.$4(OUT) U$1.DC§39(DC§039) U$80.IN X1.P$20
DCF$40: B$22.LF LP$40.$4(OUT) U$1.DC§40(DC§040) U$81.IN X1.P$18
DCF$41: LP$41.$4(OUT) U$1.DC§41(DC§041) U$82.IN X1.P$16
DCF$42: B$7.LF LP$42.$4(OUT) U$1.DC§42(DC§042) U$83.IN X1.P$14
DCF$43: LP$43.$4(OUT) U$1.DC§43(DC§043) U$14.OUT1 U$15.OUT U$84.IN X1.P$12
DCF$44: B$23.LF LP$44.$4(OUT) U$1.DC§44(DC§044) U$85.IN X1.P$10
DCF$45: B$24.LF LP$45.$4(OUT) U$1.DC§45(DC§045) U$86.IN X1.P$8
DCF$46: LP$46.$4(OUT) U$1.DC§46(DC§046) U$87.IN X1.P$6
DCF$47: LP$47.$4(OUT) U$1.DC§47(DC§047) U$88.IN X1.P$4
DCF$48: B$1.LF LP$48.$4(OUT) U$1.DC§48(DC§048) U$89.IN X1.P$2
GND: J1.49 J1.50 J1.51 J1.52 J1.53 J1.54 J1.55 J1.56 J1.57 J1.58 J1.59 J1.60 LP$1.$6(GND) LP$2.$6(GND) LP$3.$6(GND) LP$4.$6(GND) LP$5.$6(GND) LP$6.$6(GND) LP$7.$6(GND) LP$8.$6(GND) LP$9.$6(GND) LP$10.$6(GND) LP$11.$6(GND) LP$12.$6(GND) LP$13.$6(GND) LP$14.$6(GND) LP$15.$6(GND) LP$16.$6(GND) LP$17.$6(GND) LP$18.$6(GND) LP$19.$6(GND) LP$20.$6(GND) LP$21.$6(GND) LP$22.$6(GND) LP$23.$6(GND) LP$24.$6(GND) LP$25.$6(GND) LP$26.$6(GND) LP$27.$6(GND) LP$28.$6(GND) LP$29.$6(GND) LP$30.$6(GND) LP$31.$6(GND) LP$32.$6(GND) LP$33.$6(GND) LP$34.$6(GND) LP$35.$6(GND) LP$36.$6(GND) LP$37.$6(GND) LP$38.$6(GND) LP$39.$6(GND) LP$40.$6(GND) LP$41.$6(GND) LP$42.$6(GND) LP$43.$6(GND) LP$44.$6(GND) LP$45.$6(GND) LP$46.$6(GND) LP$47.$6(GND) LP$48.$6(GND) S$1.2@1(GND) S$1.2@2(GND) S$2.2@1(GND) S$2.2@2(GND) S$3.2@1(GND) S$3.2@2(GND) S$4.2@1(GND) S$4.2@2(GND) S$5.2@1(GND) S$5.2@2(GND) S$6.2@1(GND) S$6.2@2(GND) S$7.2@1(GND) S$7.2@2(GND) S$8.2@1(GND) S$8.2@2(GND) S$9.2@1(GND) S$9.2@2(GND) S$10.2@1(GND) S$10.2@2(GND) S$11.2@1(GND) S$11.2@2(GND) S$12.2@1(GND) S$12.2@2(GND) S$13.2@1(GND) S$13.2@2(GND) S$14.2@1(GND) S$14.2@2(GND) S$15.2@1(GND) S$15.2@2(GND) S$16.2@1(GND) S$16.2@2(GND) S$17.2@1(GND) S$17.2@2(GND) U$7.OUT U$10.OUT U$12.IN U$15.IN U$16.OUT U$19.IN U$21.OUT U$22.OUT U$24.IN U$28.IN U$30.OUT U$32.IN U$34.OUT U$36.IN U$38.OUT U$40.IN U$42.IN U$43.IN U$44.IN U$45.IN U$46.IN U$47.IN U$48.IN U$49.IN U$50.IN U$51.IN U$52.IN U$53.IN U$54.OUT U$55.OUT U$56.OUT U$57.OUT U$58.OUT U$59.OUT U$60.OUT U$61.OUT U$62.OUT U$63.OUT U$64.OUT U$65.OUT U$66.OUT U$67.OUT U$68.OUT U$69.OUT U$70.OUT U$71.OUT U$72.OUT U$73.OUT U$74.OUT U$75.OUT U$76.OUT U$77.OUT U$78.OUT U$79.OUT U$80.OUT U$81.OUT U$82.OUT U$83.OUT U$84.OUT U$85.OUT U$86.OUT U$87.OUT U$88.OUT U$89.OUT X1.P$49 X1.P$50
N$1 [REFL]: B$6.HF S$1.1
N$2 [REFL]: L$1.IN U$17.IN
N$3 [REFL]: B$11.HF S$8.1
N$4 [REFL]: B$12.HF S$9.1
N$5 [HF]: B$14.OUT U$1.RF$15_G5
N$6 [HF]: B$15.OUT U$1.RF$16_G6
N$7 [REFL]: B$13.HF S$10.1
N$8 [REFL]: B$14.HF S$11.1
N$9 [REFL]: U$3.P$3(OUT2) U$9.P$1(IN)
N$10 [REFL]: U$3.P$1(IN) U$4.P$2(OUT1)
N$11 [REFL]: U$2.P$1(IN) U$3.P$2(OUT1)
N$12 [HF]: B$16.OUT U$1.RF$20_G7
N$13 [REFL]: U$5.P$3(OUT2) U$6.P$1(IN)
N$14 [REFL]: U$5.P$2(OUT1) U$8.P$1(IN)
N$15 [REFL]: U$4.P$3(OUT2) U$5.P$1(IN)
N$16 [HF]: B$17.OUT U$1.RF$21_G8
N$17 [REFL]: B$7.HF U$2.P$3(OUT2)
N$18 [REFL]: L$5.IN U$29.IN
N$20 [REFL]: L$2.IN U$13.IN
N$21 [REFL]: S$5.1 U$4.P$1(IN)
N$22 [REFL]: B$1.HF U$2.P$2(OUT1)
N$23 [REFL]: B$4.HF U$8.P$3(OUT2)
N$27 [REFL]: L$3.IN U$20.IN
N$28 [REFL]: B$15.HF S$12.1
N$29 [REFL]: B$16.HF S$13.1
N$30 [REFL]: B$17.HF S$14.1
N$31 [HF]: B$6.OUT U$1.RF$03_G1
N$32 [HF]: B$11.OUT U$1.RF$04_G2
N$33 [HF]: B$12.OUT U$1.RF$08_G3
N$34 [HF]: B$13.OUT U$1.RF$09_G4
N$35 [REFL]: B$2.HF U$6.P$3(OUT2)
N$38 [REFL]: L$4.IN U$26.IN
N$39 [REFL]: B$3.HF U$6.P$2(OUT1)
N$40 [REFL]: L$6.IN U$33.IN
N$41 [REFL]: B$5.HF U$8.P$2(OUT1)
N$43 [REFL]: L$7.IN U$37.IN
N$44 [REFL]: B$8.HF U$9.P$3(OUT2)
N$46 [REFL]: L$8.IN U$41.IN
N$47 [REFL]: B$9.HF U$9.P$2(OUT1)
N$48 [REFL]: B$10.HF S$2.1
N$49 [REFL]: B$18.HF S$3.1
N$50 [HF]: B$18.OUT U$1.RF$28_G10
N$51 [HF]: B$10.OUT U$1.RF$27_G9
N$52 [REFL]: B$19.HF S$4.1
N$53 [REFL]: B$20.HF S$6.1
N$54 [HF]: B$20.OUT U$1.RF$33_G12
N$55 [HF]: B$19.OUT U$1.RF$32_G11
N$56 [REFL]: B$21.HF S$7.1
N$57 [REFL]: B$22.HF S$15.1
N$58 [REFL]: B$23.HF S$16.1
N$59 [REFL]: B$24.HF S$17.1
N$60 [HF]: B$24.OUT U$1.RF$45_G16
N$61 [HF]: B$23.OUT U$1.RF$44_G15
N$62 [HF]: B$22.OUT U$1.RF$40_G14
N$63 [HF]: B$21.OUT U$1.RF$39_G13
RF$1 [REFL]: B$1.OUT U$10.IN U$13.OUT
RF$2 [REFL]: B$2.OUT U$16.IN U$20.OUT
RF$3 [REFL]: B$3.OUT U$22.IN U$26.OUT
RF$4 [REFL]: B$7.OUT U$7.IN U$17.OUT
RF$5 [REFL]: B$4.OUT U$21.IN U$29.OUT
RF$6 [REFL]: B$5.OUT U$30.IN U$33.OUT
RF$7 [REFL]: B$8.OUT U$34.IN U$37.OUT
RF$8 [REFL]: B$9.OUT U$38.IN U$41.OUT
RF$R1: L$3.OUT U$1.RF$06_R1 U$18.OUT
RF$R2: L$4.OUT U$1.RF$12_R2 U$23.OUT
RF$R3: L$5.OUT U$1.RF$18_R3 U$27.OUT
RF$R4: L$6.OUT U$1.RF$24_R4 U$31.OUT
RF$R5: L$7.OUT U$1.RF$30_R5 U$35.OUT
RF$R6: L$8.OUT U$1.RF$36_R6 U$39.OUT
RF$R7: L$1.OUT U$1.RF$42_R7 U$14.OUT
RF$R8: L$2.OUT U$1.RF$48_R8 U$11.OUT
Unconnected: U$1.RF$GND U$1.RF$GND1 U$1.RF$GND2 U$1.RF$GND3 U$1.RF$GND4 U$1.RF$GND5 U$1.RF$GND6 U$1.RF$GND7

## Notes on the sheet
- V0.5 Added Grounding Connector
  RS180-3958 and
  RS7792797
- Coupling cap
  (optional)
- Pi match cap
- Pi match cap
- Coupling cap
  (optional)
- Coupling cap
  (optional)
- Pi match cap
- Pi match cap
- Coupling cap
  (optional)
- Coupling cap
  (optional)
- V0.4: Added GND to empty Pins 49-51
- Pi match cap
- Pi match cap
- Coupling cap
  (optional)
- Coupling cap
  (optional)
- Pi match cap
- Pi match cap
- Coupling cap
  (optional)

## Library data of the parts
B$1-B$24 = Bias tee:BIASTEE
J1 = MEC8-130-XX-XX-D-EM2:MEC8-130-XX-XX-D-CARD: 0.8mm DUAL EDGE MOUNT MINI-EDGE CARD ASSEMBLY
L$1-L$8 = MatchCircuit:L_MATCH
LP$1-LP$48 = LPFilter:LP-FILTER/1-STAGE
S$1-S$17 = RF Connectors:MC-921: COAX. MICROWAVE CONNECTOR O/D diam 2.1 Source: www.tycoelectronics.com .. Electronics .. ENG_CD_1775146_A2.pdf
U$1 = SampleArea:48DC+24RF_V3.0
U$2-U$6 U$8 U$9 = RF layout parts:TJUNCTION
U$7 U$10 U$12 U$13 U$15-U$17 U$19-U$22 U$24 U$26 U$28-U$30 U$32-U$34 U$36-U$38 U$40-U$89 = LPFilter:LP-FILTER/CAPACITOR/0603
U$11 U$14 U$18 U$23 U$27 U$31 U$35 U$39 = LPFilter:LP-FILTER/VARACTOR_V2
X1 = con-molex_mod:87758-5016: 50 Pin - 2mm Dual Row Single Wafer, Vertical T/H HDR Source: http://www.molex.com/pdm_docs/sd/877580616_sd.pdf

## Net classes
0 GND: clearance 0.15 mm
1 HF: width 0.15 mm, clearance 0.25 mm
2 REFL: width 0.8 mm, clearance 0.8 mm